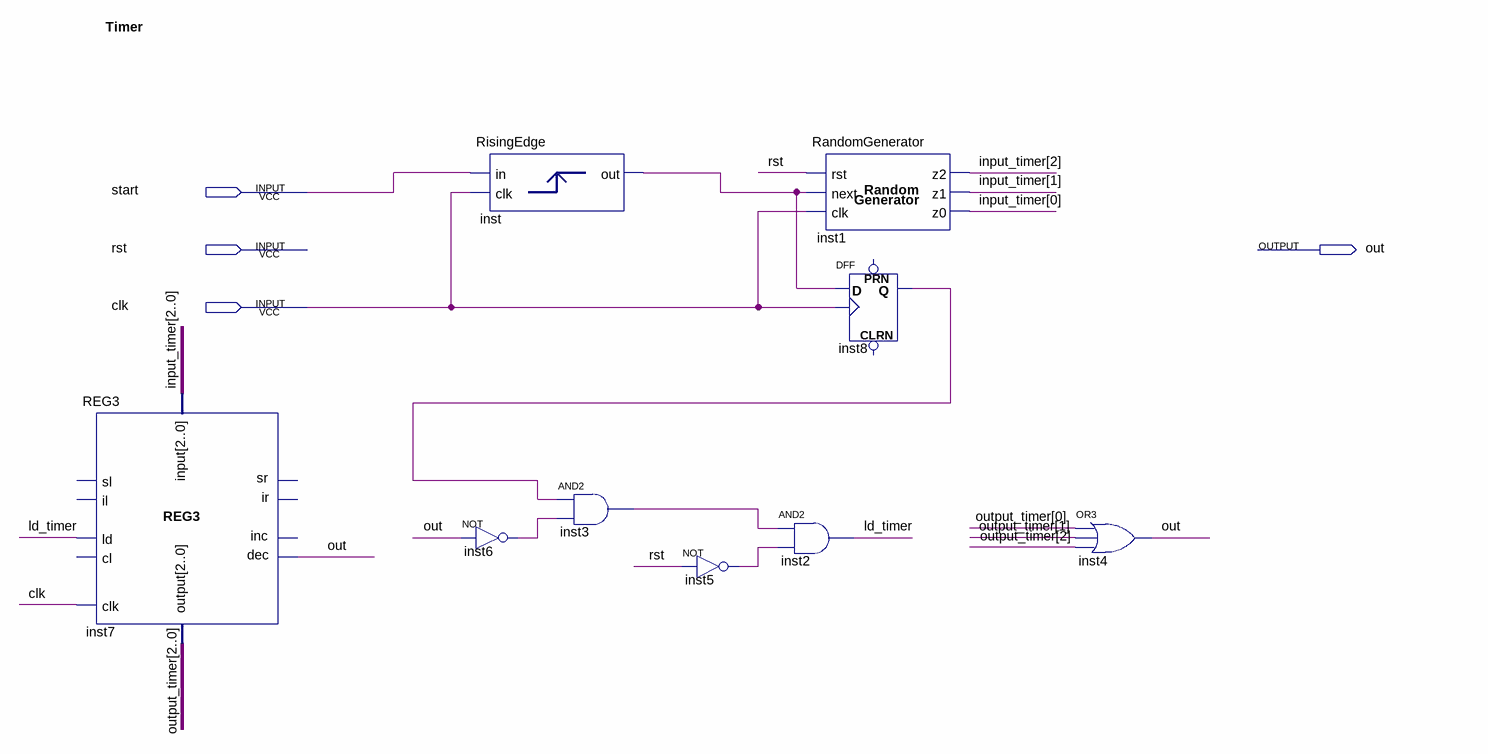
[diagram p0: schematic sheet]
// Quartus schematic Timer.bdf as structural Verilog: 9 symbols, 4 pins
module Timer (
  input  start,
  input  rst,
  input  clk,
  output out
);

  wire inst3_out, inst5_out, inst6_out, inst8_q, inst_output, ld_timer;
  wire [2:0] input_timer, output_timer;

  REG3 inst7 (
    .clk(clk), .ld(ld_timer), .\input (input_timer), .dec(out), .\output (output_timer));  // open: sr, ir, sl, il, inc, cl
  RisingEdge inst (.clk(clk), .\input (start), .\output (inst_output));
  not inst6 (inst6_out, out);
  and inst3 (inst3_out, inst8_q, inst6_out);
  not inst5 (inst5_out, rst);
  and inst2 (ld_timer, inst3_out, inst5_out);
  RandomGenerator inst1 (
    .NXT(inst_output), .RST(rst), .CLK(clk), .Z2(input_timer[2]), .Z1(input_timer[1]), .Z0(input_timer[0]));
  DFF inst8 (.CLK(clk), .D(inst_output), .Q(inst8_q));  // open: CLRN, PRN
  or inst4 (out, output_timer[0], output_timer[1], output_timer[2]);

  // Notes on the sheet:
  //   Timer
endmodule
